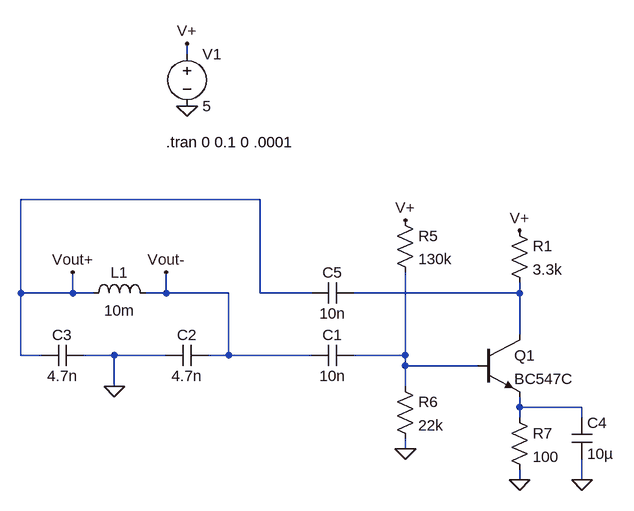
[diagram p0: schematic 06A-05.asc]
06A-05.asc, the LTspice schematic file:
Version 4
SHEET 1 880 680
WIRE -144 -256 -144 -272
WIRE -32 -32 -400 -32
WIRE -400 112 -400 -32
WIRE -320 112 -320 80
WIRE -320 112 -400 112
WIRE -288 112 -320 112
WIRE -176 112 -176 80
WIRE -176 112 -208 112
WIRE -80 112 -176 112
WIRE -32 112 -32 -32
WIRE 48 112 -32 112
WIRE 368 112 368 96
WIRE 368 112 112 112
WIRE 368 176 368 112
WIRE -400 208 -400 112
WIRE -368 208 -400 208
WIRE -256 208 -304 208
WIRE -176 208 -256 208
WIRE -80 208 -80 112
WIRE -80 208 -112 208
WIRE 48 208 -80 208
WIRE 192 208 192 80
WIRE 192 208 112 208
WIRE 192 224 192 208
WIRE 304 224 192 224
WIRE -256 256 -256 208
WIRE 192 256 192 224
WIRE 368 288 368 272
WIRE 464 288 368 288
WIRE 368 304 368 288
WIRE 464 304 464 288
WIRE 192 352 192 336
WIRE 368 400 368 384
WIRE 464 400 464 368
FLAG -144 -176 0
FLAG -144 -272 V+
FLAG 368 16 V+
FLAG 192 352 0
FLAG 192 0 V+
FLAG 368 400 0
FLAG 464 400 0
FLAG -256 256 0
FLAG -176 80 Vout-
FLAG -320 80 Vout+
SYMBOL npn 304 176 R0
SYMATTR InstName Q1
SYMATTR Value BC547C
SYMBOL res 352 0 R0
SYMATTR InstName R1
SYMATTR Value 3.3k
SYMBOL cap 112 192 R90
WINDOW 0 0 32 VBottom 2
WINDOW 3 32 32 VTop 2
SYMATTR InstName C1
SYMATTR Value 10n
SYMBOL cap -112 192 R90
WINDOW 0 0 32 VBottom 2
WINDOW 3 32 32 VTop 2
SYMATTR InstName C2
SYMATTR Value 4.7n
SYMBOL cap -304 192 R90
WINDOW 0 0 32 VBottom 2
WINDOW 3 32 32 VTop 2
SYMATTR InstName C3
SYMATTR Value 4.7n
SYMBOL voltage -144 -272 R0
WINDOW 123 0 0 Left 0
WINDOW 39 0 0 Left 0
SYMATTR InstName V1
SYMATTR Value 5
SYMBOL res 176 -16 R0
SYMATTR InstName R5
SYMATTR Value 130k
SYMBOL res 176 240 R0
SYMATTR InstName R6
SYMATTR Value 22k
SYMBOL res 352 288 R0
SYMATTR InstName R7
SYMATTR Value 100
SYMBOL cap 448 304 R0
SYMATTR InstName C4
SYMATTR Value 10µ
SYMBOL cap 112 96 R90
WINDOW 0 0 32 VBottom 2
WINDOW 3 32 32 VTop 2
SYMATTR InstName C5
SYMATTR Value 10n
SYMBOL ind -304 128 R270
WINDOW 0 32 56 VTop 2
WINDOW 3 5 56 VBottom 2
SYMATTR InstName L1
SYMATTR Value 10m
TEXT -176 -120 Left 2 !.tran 0 0.1 0 .0001

The netlist it stands for:
* 06A-05.asc
Q1 N001 N002 N003 0 BC547C
R1 V+ N001 3.3k
C1 N002 Vout- 10n
C2 Vout- 0 4.7n
C3 0 Vout+ 4.7n
V1 V+ 0 5
R5 V+ N002 130k
R6 N002 0 22k
R7 N003 0 100
C4 N003 0 10µ
C5 N001 Vout+ 10n
L1 Vout+ Vout- 10m
.model NPN NPN
.model PNP PNP
.lib standard.bjt
.tran 0 0.1 0 .0001
.backanno
.end